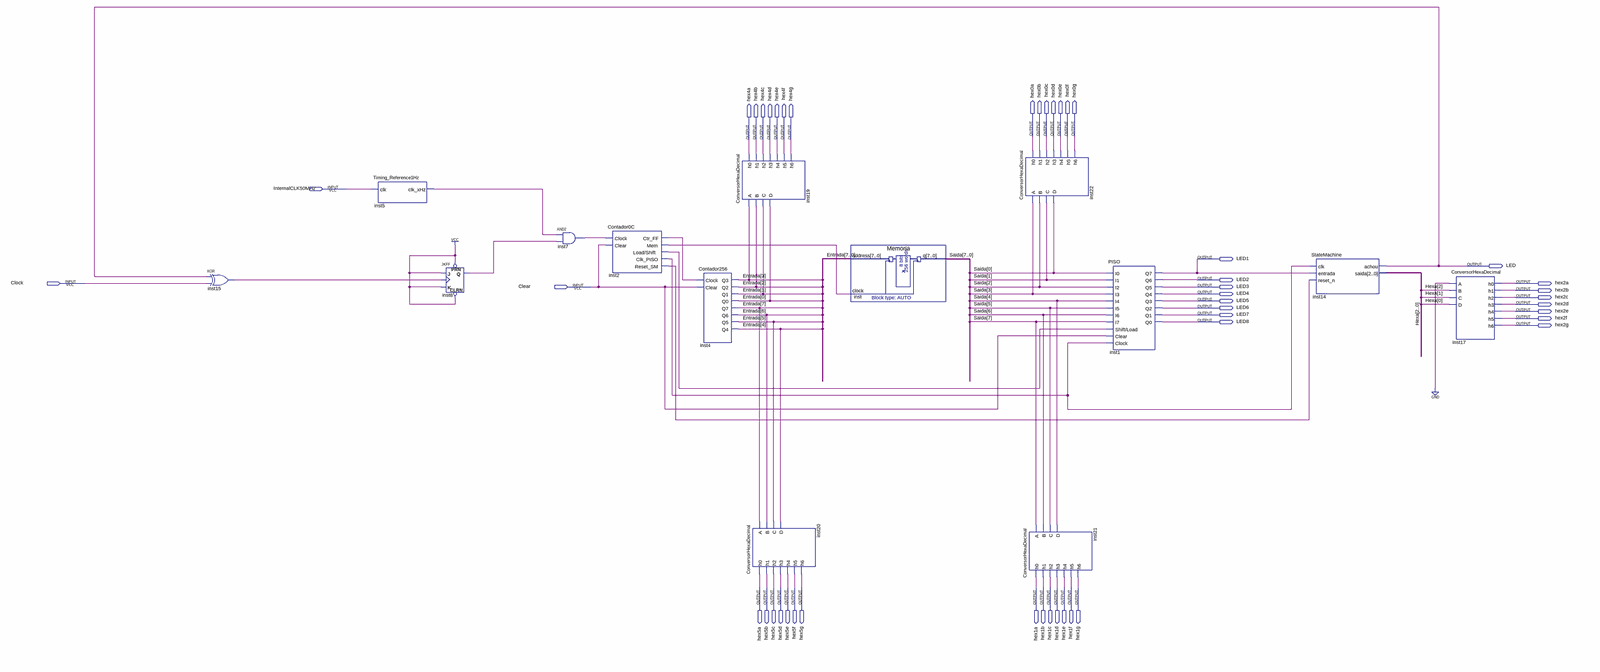
[diagram p0: schematic sheet, whole]
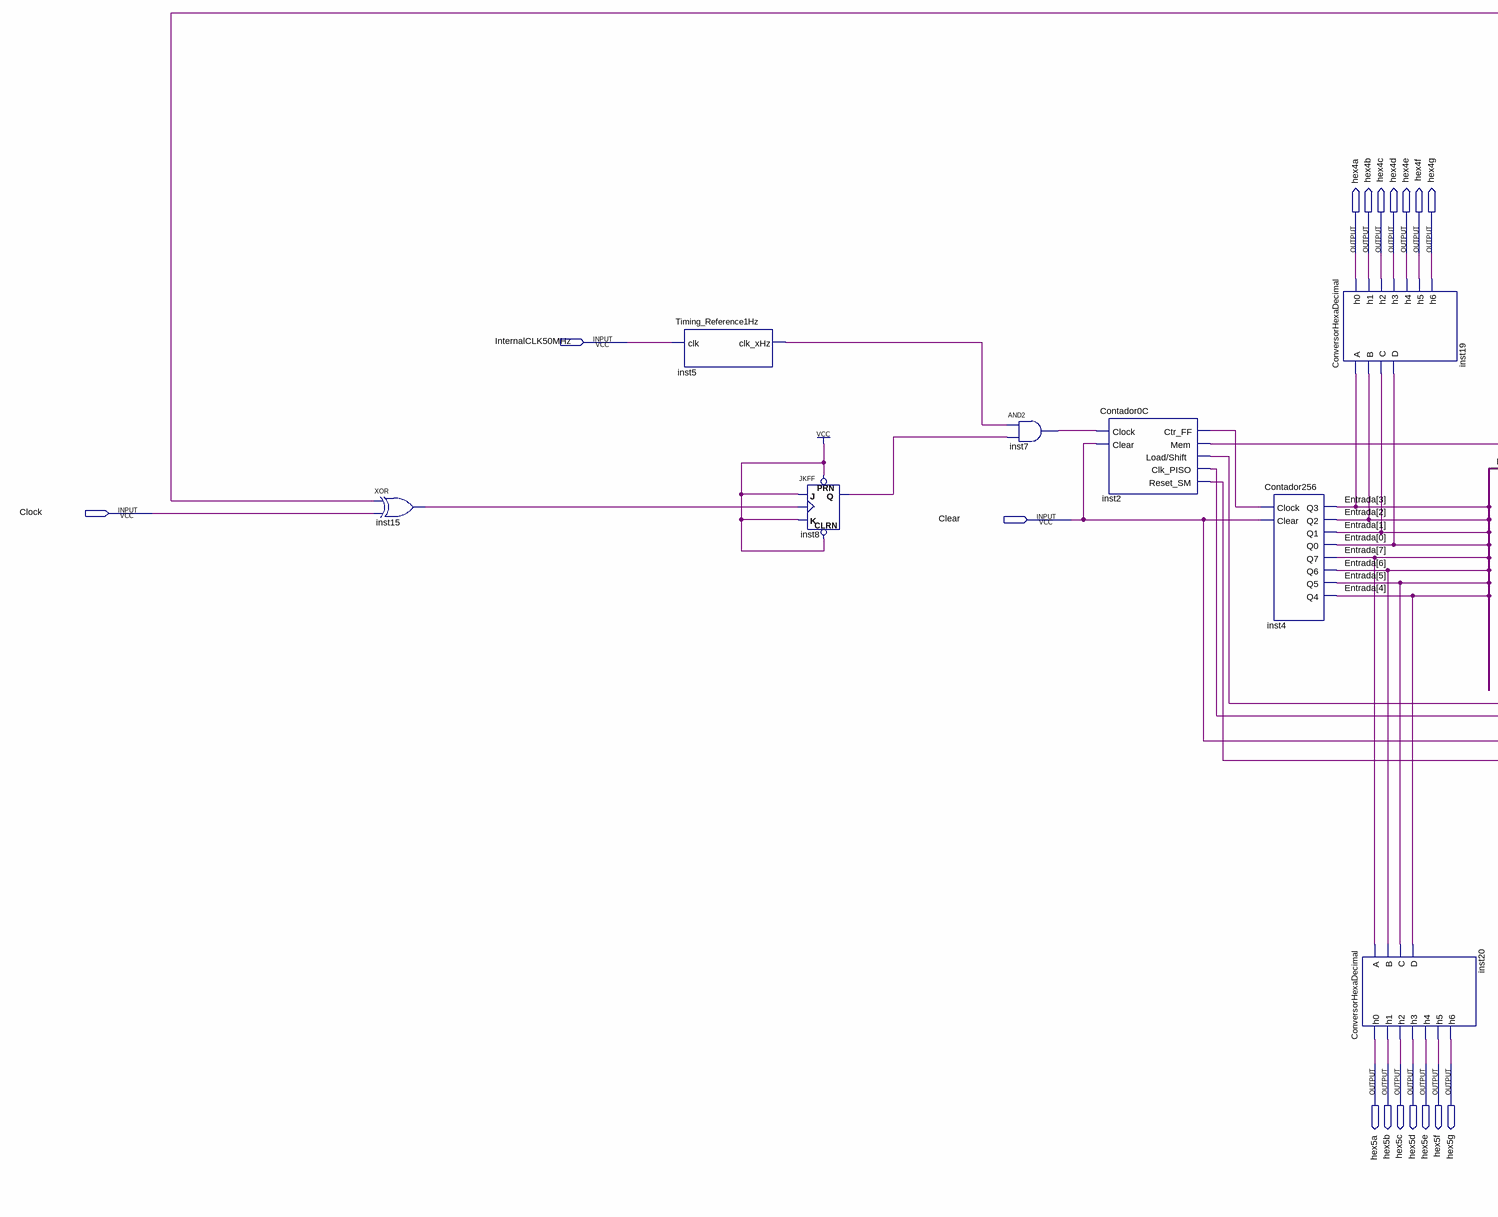
[diagram p1: schematic sheet, left part]
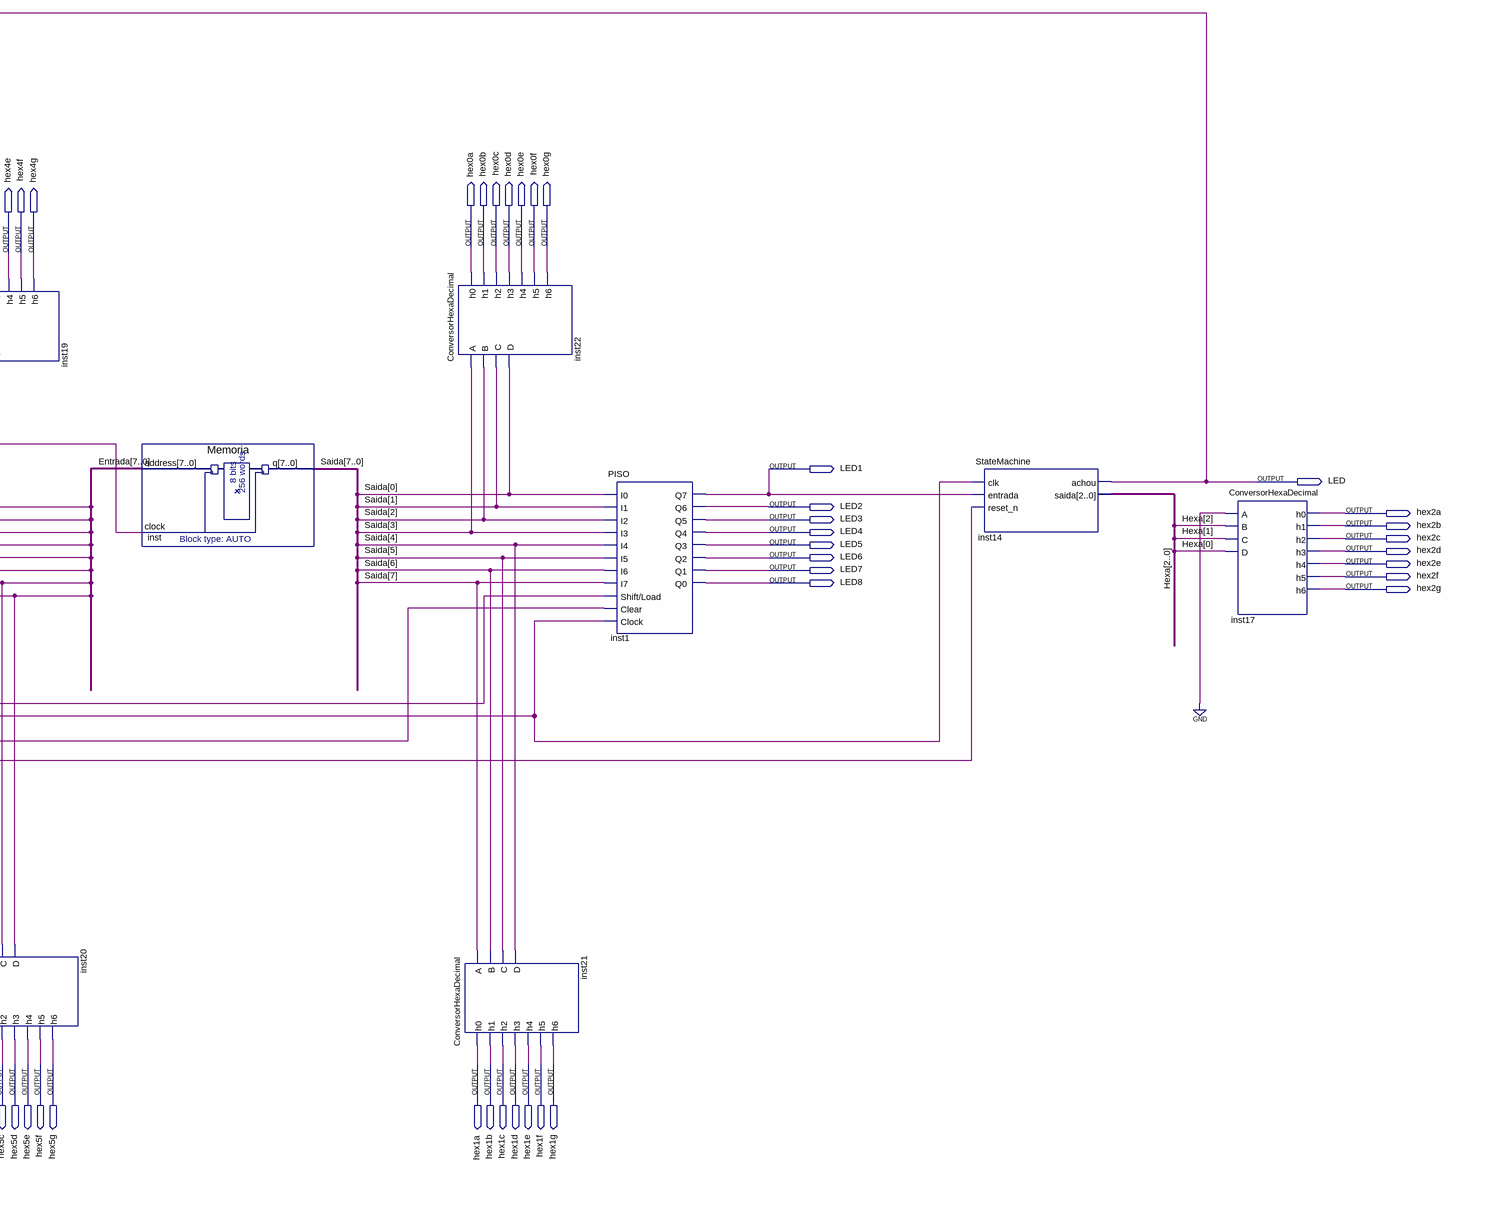
[diagram p2: schematic sheet, right part]
// Quartus schematic LAB7.bdf as structural Verilog: 14 symbols, 47 pins
module LAB7 (
  input  InternalCLK50MHz,
  input  Clock,
  input  Clear,
  output hex0a,
  output hex0b,
  output hex0c,
  output hex0d,
  output hex0e,
  output hex0f,
  output hex0g,
  output hex4a,
  output hex4b,
  output hex4c,
  output hex4d,
  output hex4e,
  output hex4f,
  output hex4g,
  output LED1,
  output LED,
  output LED2,
  output hex2a,
  output LED3,
  output hex2b,
  output LED4,
  output hex2c,
  output LED5,
  output hex2d,
  output LED6,
  output hex2e,
  output LED7,
  output hex2f,
  output LED8,
  output hex2g,
  output hex5a,
  output hex5b,
  output hex5c,
  output hex5d,
  output hex5e,
  output hex5f,
  output hex5g,
  output hex1a,
  output hex1b,
  output hex1c,
  output hex1d,
  output hex1e,
  output hex1f,
  output hex1g
);

  wire inst2_clk_piso, inst2_ctr_ff, inst2_load_shift, inst2_mem, inst2_reset_sm, inst5_clk_xhz, inst7_out,
       inst8_q, inst15_out;
  wire [2:0] Hexa;
  wire [7:0] Entrada, Saida;

  xor inst15 (inst15_out, LED, Clock);
  Timing_Reference1Hz inst5 (.clk(InternalCLK50MHz), .clk_xHz(inst5_clk_xhz));
  JKFF inst8 (.PRN(1'b1), .CLRN(1'b1), .K(1'b1), .J(1'b1), .CLK(inst15_out), .Q(inst8_q));
  and inst7 (inst7_out, inst5_clk_xhz, inst8_q);
  Contador0C inst2 (
    .Clock(inst7_out), .Clear(Clear), .Ctr_FF(inst2_ctr_ff), .Mem(inst2_mem),
    .\Load/Shift (inst2_load_shift), .Clk_PISO(inst2_clk_piso), .Reset_SM(inst2_reset_sm));
  Contador256 inst4 (
    .Clock(inst2_ctr_ff), .Clear(Clear), .Q3(Entrada[3]), .Q2(Entrada[2]), .Q1(Entrada[1]), .Q0(Entrada[0]),
    .Q7(Entrada[7]), .Q6(Entrada[6]), .Q5(Entrada[5]), .Q4(Entrada[4]));
  ConversorHexaDecimal inst19 (
    .A(Entrada[3]), .B(Entrada[2]), .C(Entrada[1]), .D(Entrada[0]), .h0(hex4a), .h1(hex4b), .h2(hex4c),
    .h3(hex4d), .h4(hex4e), .h5(hex4f), .h6(hex4g));
  ConversorHexaDecimal inst20 (
    .A(Entrada[7]), .B(Entrada[6]), .C(Entrada[5]), .D(Entrada[4]), .h0(hex5a), .h1(hex5b), .h2(hex5c),
    .h3(hex5d), .h4(hex5e), .h5(hex5f), .h6(hex5g));
  Memoria inst (.address(Entrada), .clock(inst2_mem), .q(Saida));
  ConversorHexaDecimal inst22 (
    .A(Saida[3]), .B(Saida[2]), .C(Saida[1]), .D(Saida[0]), .h0(hex0a), .h1(hex0b), .h2(hex0c), .h3(hex0d),
    .h4(hex0e), .h5(hex0f), .h6(hex0g));
  ConversorHexaDecimal inst21 (
    .A(Saida[7]), .B(Saida[6]), .C(Saida[5]), .D(Saida[4]), .h0(hex1a), .h1(hex1b), .h2(hex1c), .h3(hex1d),
    .h4(hex1e), .h5(hex1f), .h6(hex1g));
  PISO inst1 (
    .I0(Saida[0]), .I1(Saida[1]), .I2(Saida[2]), .I3(Saida[3]), .I4(Saida[4]), .I5(Saida[5]), .I6(Saida[6]),
    .I7(Saida[7]), .\Shift/Load (inst2_load_shift), .Clear(Clear), .Clock(inst2_clk_piso), .Q7(LED1),
    .Q6(LED2), .Q5(LED3), .Q4(LED4), .Q3(LED5), .Q2(LED6), .Q1(LED7), .Q0(LED8));
  StateMachine inst14 (.clk(inst2_clk_piso), .entrada(LED1), .reset_n(inst2_reset_sm), .achou(LED), .saida(Hexa));
  ConversorHexaDecimal inst17 (
    .A(1'b0), .B(Hexa[2]), .C(Hexa[1]), .D(Hexa[0]), .h0(hex2a), .h1(hex2b), .h2(hex2c), .h3(hex2d),
    .h4(hex2e), .h5(hex2f), .h6(hex2g));
endmodule
